# EasyEDA Pro project tmkibot1_2.1 MAX7219 – 8×8 Dot Matrix.eprj

# Schematic Schematic1
Board Name: Board1; Create Date: 2025-09-20; Page Name: P1; Project Name: tmkibot1_2.1 MAX7219 – 8×8 Dot Matrix; Schematic Name: Schematic1; Update Date: 2025-09-20; Company: EasyEDA.com; Page Size: A4; Version: V1.0
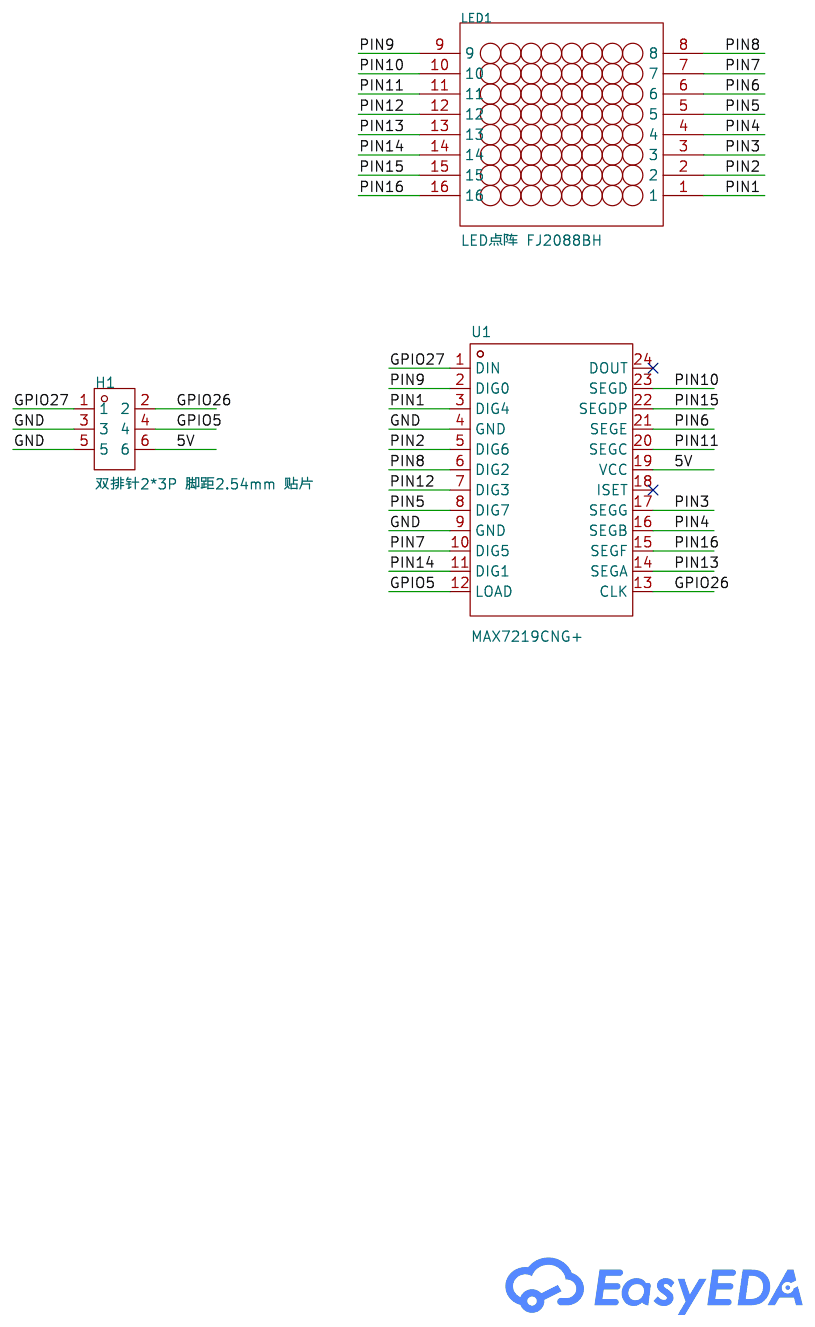
[diagram p0: schematic sheet]

## Parts
H1  双排针2*3P 脚距2.54mm 贴片  [HDR-SMD_6P-P2.54-V-M-R2-C3-S2.54-LS7.4]
LED1  LED点阵 FJ2088BH  [LED-ARRAY-TH_L61.0-W61.0-P2.54-LS45.7-L]
U1  MAX7219CNG+  [DIP-24_L31.7-W6.6-P2.54-LS7.6-BL-2]

## Library data of the parts
H1 = 双排针2*3P 脚距2.54mm 贴片: LCSC Part Name: 间距:2.54mm; Supplier Part: C77761; Manufacturer: BOOMELE(博穆精密); Supplier Footprint: SMD,P=2.54mm; JLCPCB Part Class: Extended Part; Supplier: LCSC; Pitch: 2.54mm; Row Spacing: 2.54mm; Number of Rows: 2; Number of Pins: 6P; Color: Black
LED1 = LED点阵 FJ2088BH: LCSC Part Name: 8x8位共阴极红色LED点阵; Supplier Part: C53078; Manufacturer: 志浩; Supplier Footprint: 插件; JLCPCB Part Class: Extended Part; Datasheet: https://atta.szlcsc.com/upload/public/pdf/source/20151111/1457707576541.pdf; Supplier: LCSC; Dot Matrix Number: 8x8; Emitting Color: Red; Polarity: 共阴极
U1 = MAX7219CNG+: LCSC Part Name: 串行接口8位LED显示驱动器; Supplier Part: C29160; Manufacturer: ADI(亚德诺)/MAXIM(美信); Supplier Footprint: DIP-24-300mil; JLCPCB Part Class: Extended Part; Datasheet: https://item.szlcsc.com/datasheet/MAX7219CNG%252B/29912.html; Supplier: LCSC

## Nets
5V: H1.6 U1.19(VCC)
GND: H1.3 H1.5 U1.4(GND) U1.9(GND)
GPIO5: H1.4 U1.12(LOAD)
GPIO26: H1.2 U1.13(CLK)
GPIO27: H1.1 U1.1(DIN)
PIN1: LED1.1 U1.3(DIG4)
PIN2: LED1.2 U1.5(DIG6)
PIN3: LED1.3 U1.17(SEGG)
PIN4: LED1.4 U1.16(SEGB)
PIN5: LED1.5 U1.8(DIG7)
PIN6: LED1.6 U1.21(SEGE)
PIN7: LED1.7 U1.10(DIG5)
PIN8: LED1.8 U1.6(DIG2)
PIN9: LED1.9 U1.2(DIG0)
PIN10: LED1.10 U1.23(SEGD)
PIN11: LED1.11 U1.20(SEGC)
PIN12: LED1.12 U1.7(DIG3)
PIN13: LED1.13 U1.14(SEGA)
PIN14: LED1.14 U1.11(DIG1)
PIN15: LED1.15 U1.22(SEGDP)
PIN16: LED1.16 U1.15(SEGF)

Not connected (* = marked no-connect by the designer): U1 18(ISET)* 24(DOUT)*

# Board PCB1
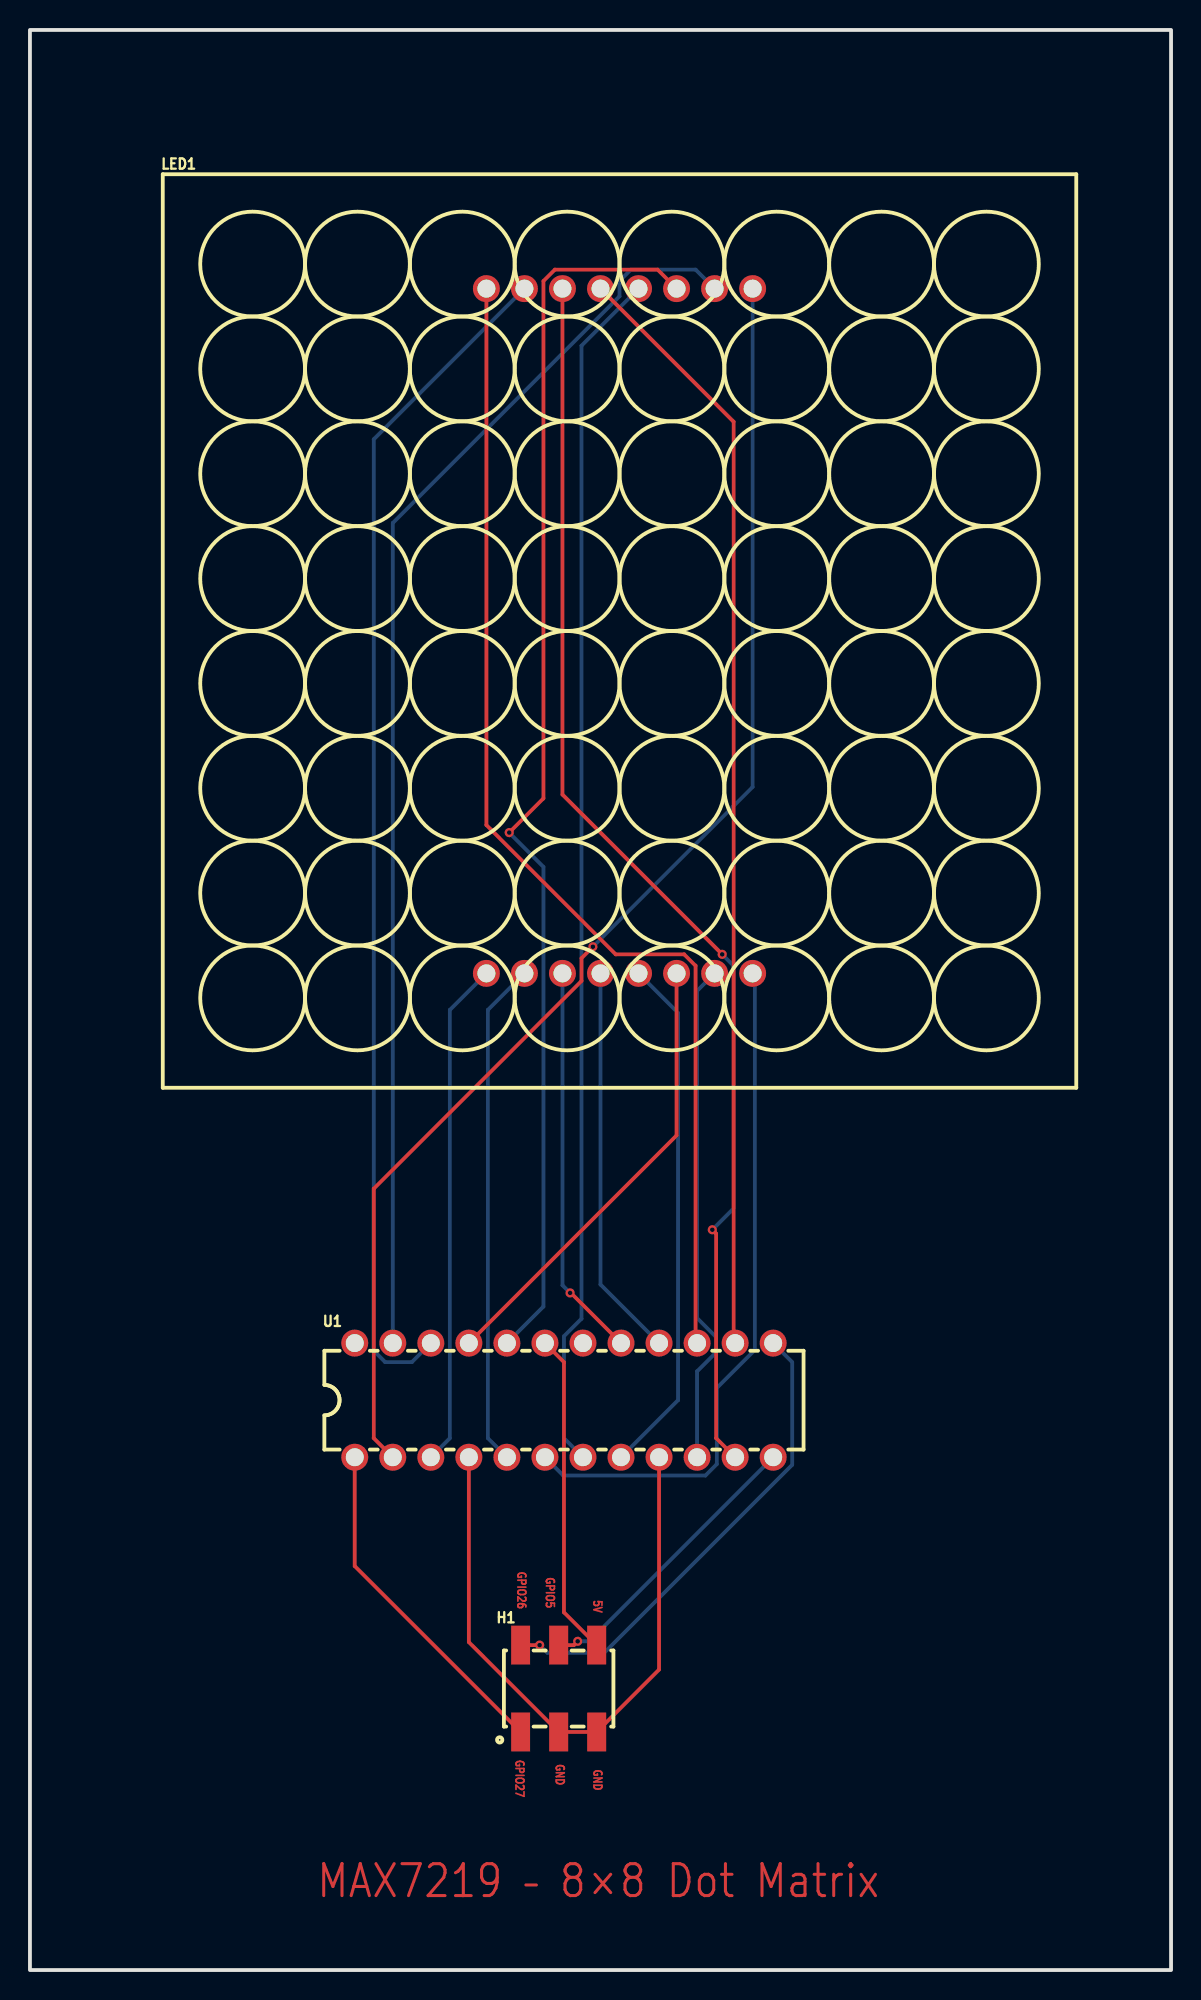
[diagram p1: board, top side]
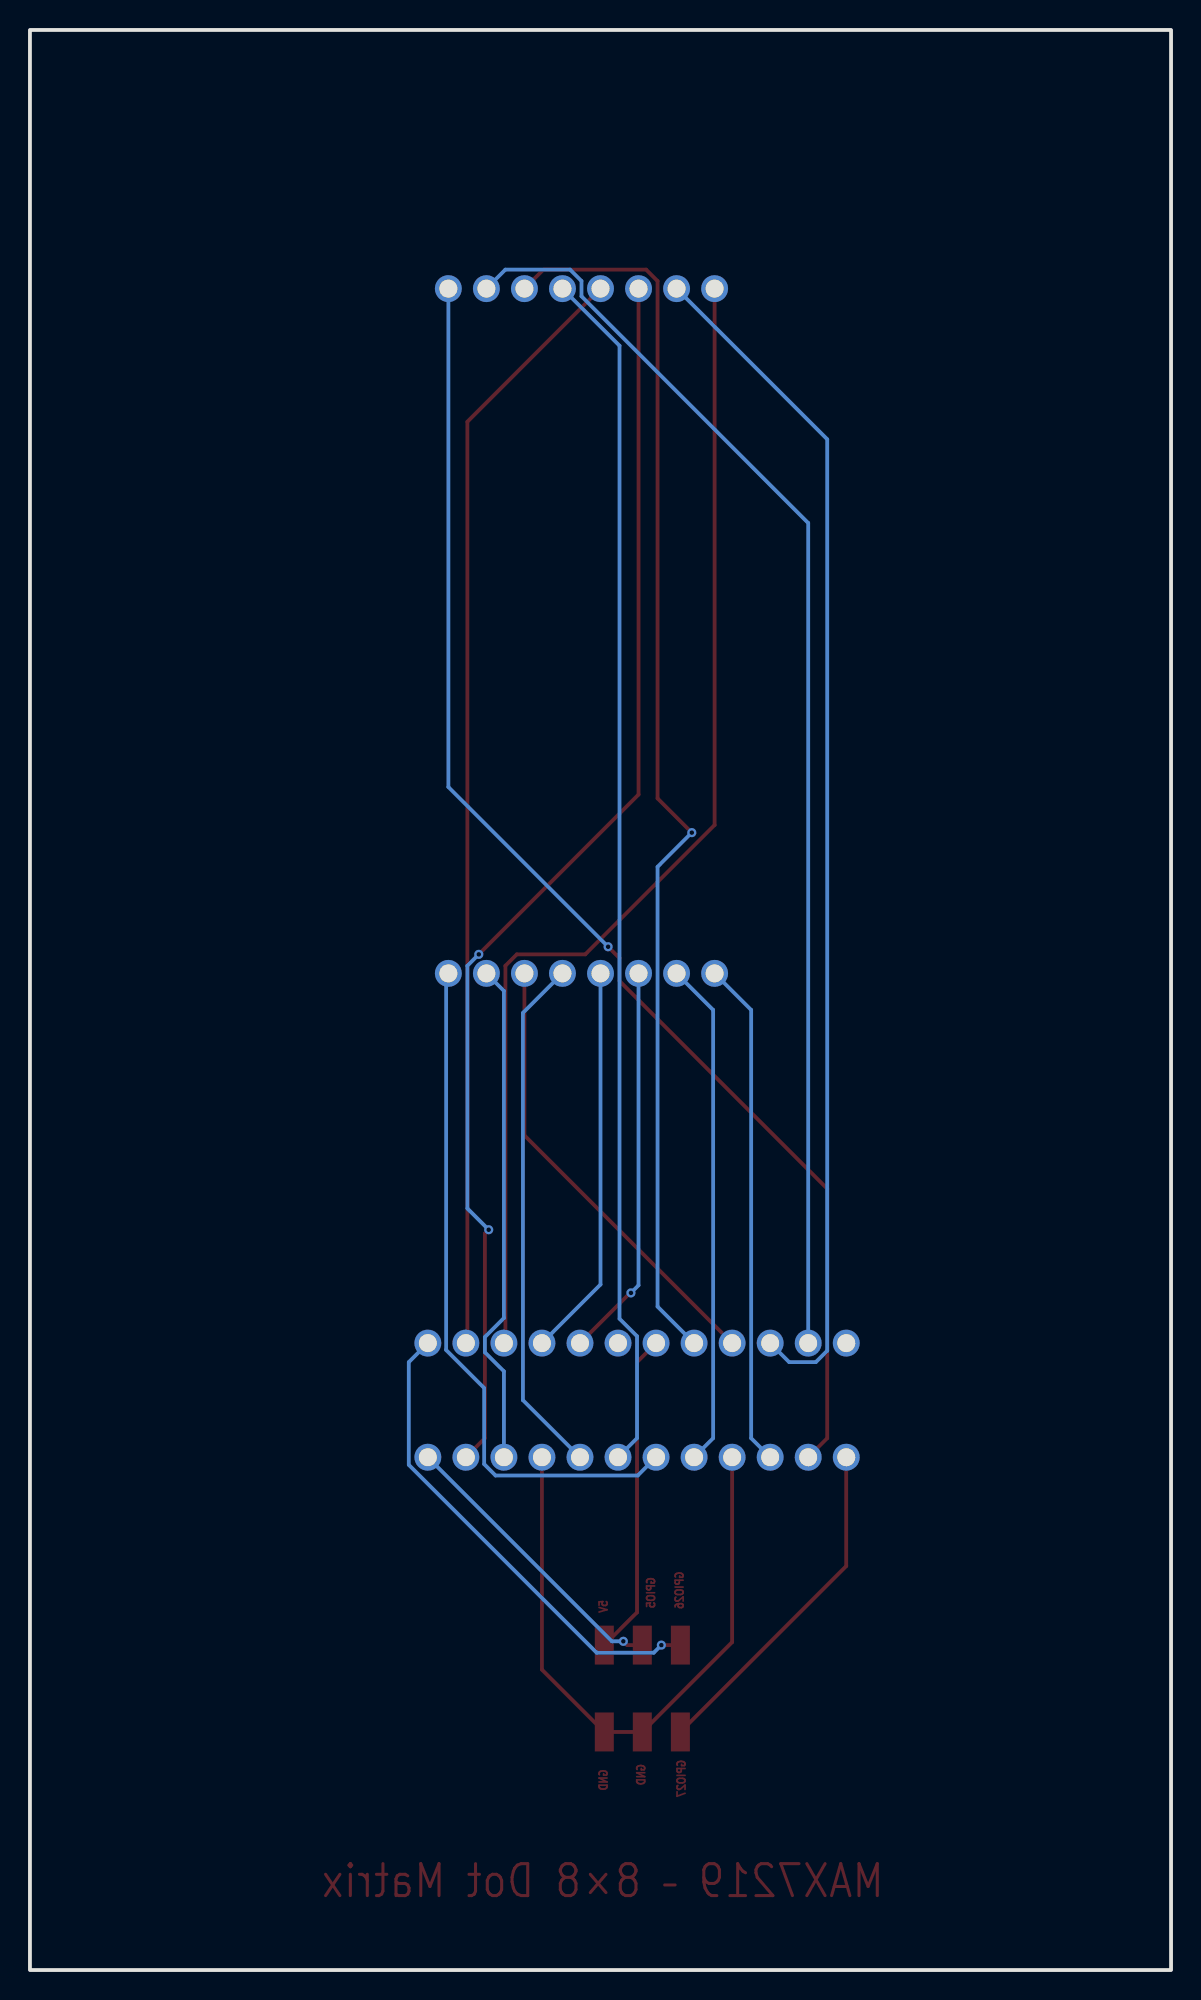
[diagram p2: board, bottom side, seen from below]

Outline 76.2 x 129.54 mm; copper layers: Top Layer, Bottom Layer. Coordinates in mm from the lower left corner of the outline.
Outline path: rectangle 0,129.54 76.2,0
Stack: Top Layer 0.035mm / Dielectric1 1.51mm FR4 er 4.5 / Bottom Layer 0.035mm

## Design rules (mm)
template: JLCPCB Capability(Two Layers Board)
spacing copperThickness1oz (default): track to track 0.102, other pairs 0.152 to 0.3
spacing copperThickness2oz: track to track 0.203, other pairs 0.152 to 0.3
track width copperThickness1oz (default): min 0.127, default 0.254, max 2.54
track width copperThickness2oz: min 0.203, default 0.254, max 2.54
differential pair differentialPair (default): width min 0.127, default 0.254, max 2.54; gap min 0.152, default 0.152
via viaSize (default): diameter min 0.5, default 0.61, max 10; hole min 0.3, default 0.305, max 6.3

## Placement (name value [footprint] x y rotation side)
H1  双排针2*3P 脚距2.54mm 贴片  [HDR-SMD_6P-P2.54-V-M-R2-C3-S2.54-LS7.4]  35.31 18.8 0 top
LED1  LED点阵 FJ2088BH  [LED-ARRAY-TH_L61.0-W61.0-P2.54-LS45.7-L]  39.37 89.41 0 top
U1  MAX7219CNG+  [DIP-24_L31.7-W6.6-P2.54-LS7.6-BL-2]  35.66 38.05 0 top

## Footprints (pads in the part's own frame, mm; a bottom-side part is the same pattern mirrored in y, then rotated)
DIP-24_L31.7-W6.6-P2.54-LS7.6-BL-2
  round 1.8 hole 1.2: 1(-13.97,-3.81) 2(-11.43,-3.81) 3(-8.89,-3.81) 4(-6.35,-3.81) 5(-3.81,-3.81) 6(-1.27,-3.81) 7(1.27,-3.81) 8(3.81,-3.81) 9(6.35,-3.81) 10(8.89,-3.81) 11(11.43,-3.81) 12(13.97,-3.81) 13(13.97,3.81) 14(11.43,3.81) 15(8.89,3.81) 16(6.35,3.81) 17(3.81,3.81) 18(1.27,3.81) 19(-1.27,3.81) 20(-3.81,3.81) 21(-6.35,3.81) 22(-8.89,3.81) 23(-11.43,3.81) 24(-13.97,3.81)
HDR-SMD_6P-P2.54-V-M-R2-C3-S2.54-LS7.4
  rect 1.27x2.6 smd: 1(-2.54,-2.9) 2(-2.54,2.9) 3(0,-2.9) 4(0,2.9) 5(2.54,-2.9) 6(2.54,2.9)
LED-ARRAY-TH_L61.0-W61.0-P2.54-LS45.7-L
  round 1.8 hole 1.2: 1(-8.89,-22.86) 2(-6.35,-22.86) 3(-3.81,-22.86) 4(-1.27,-22.86) 5(1.27,-22.86) 6(3.81,-22.86) 7(6.35,-22.86) 8(8.89,-22.86) 9(8.89,22.86) 10(6.35,22.86) 11(3.81,22.86) 12(1.27,22.86) 13(-1.27,22.86) 14(-3.81,22.86) 15(-6.35,22.86) 16(-8.89,22.86)

## Nets
As in the schematic.

Pads without a net: U1 18 24

## Via types
v1: diameter 0.61, hole 0.305, Top Layer to Bottom Layer, 7 vias

## Routing (per net, layer and track width the routed paths; a pad name or vN(x,y) marks a point on that pad's centre or on a via; arc(x,y) is an arc through that point)
5V: length 21.6
  Top Layer w0.254: 37.85,21.7 35.66,23.88 35.66,40.59 U1.19
GND: length 43.4
  Top Layer w0.254: U1.9 42.01,20.06 H1.5 H1.3 29.31,21.89 U1.4
GPIO5: length 19.5
  Top Layer w0.254: 35.31,21.7 36.32,21.7 v1(36.58,21.95)
  Bottom Layer w0.254: U1.12 37.34,21.95 v1(36.58,21.95)
GPIO26: length 32.2
  Top Layer w0.254: 32.77,21.7 v1(34.04,21.7)
  Bottom Layer w0.254: U1.13 50.9,40.59 50.9,33.73 38.35,21.19 34.54,21.19 v1(34.04,21.7)
GPIO27: length 22.9
  Top Layer w0.254: U1.1 21.69,26.97 H1.1
PIN1: length 33.8
  Bottom Layer w0.254: U1.3 28.04,35.51 28.04,64.11 LED1.1
PIN2: length 33.8
  Bottom Layer w0.254: U1.5 30.58,35.51 30.58,64.11 LED1.2
PIN3: length 26.3
  Top Layer w0.254: U1.17 36.12,45.21 v1(36.07,45.21)
  Bottom Layer w0.254: LED1.3 35.56,45.72 v1(36.07,45.21)
PIN4: length 26.3
  Bottom Layer w0.254: LED1.4 38.1,45.77 U1.16
PIN5: length 35
  Bottom Layer w0.254: LED1.5 43.28,63.91 43.28,38.05 U1.8
PIN6: length 30.4
  Top Layer w0.254: U1.21 43.18,55.73 LED1.6
PIN7: length 33.8
  Bottom Layer w0.254: LED1.7 44.55,65.38 44.55,43.53 45.82,42.26 45.82,41.25 44.55,39.98 U1.10
PIN8: length 46.2
  Bottom Layer w0.254: U1.6 35.61,33.02 45.11,33.02 45.87,33.78 45.87,38.86 48.41,41.4 48.41,66.4 LED1.8
PIN9: length 89
  Top Layer w0.254: v1(37.59,68.33) 36.83,67.56 36.83,66.04 22.96,52.17 22.96,35.51 U1.2
  Bottom Layer w0.254: LED1.9 48.26,78.99 v1(37.59,68.33)
PIN10: length 84.4
  Bottom Layer w0.254: LED1.10 44.45,113.54 40.13,113.54 39.37,112.78 39.37,111.76 24.23,96.62 U1.23
PIN11: length 83.6
  Top Layer w0.254: LED1.11 41.91,113.54 35.05,113.54 34.29,112.78 34.29,78.23 v1(32,75.95)
  Bottom Layer w0.254: v1(32,75.95) 34.29,73.66 34.29,44.3 U1.20
PIN12: length 80.6
  Bottom Layer w0.254: U1.7 35.66,35.51 35.66,42.32 36.83,43.49 36.83,108.46 LED1.12
PIN13: length 74.1
  Top Layer w0.254: U1.14 46.99,41.96 46.99,103.38 LED1.13
PIN14: length 84
  Top Layer w0.254: v1(45.57,49.43) 45.82,49.18 45.82,35.51 U1.11 ; v1(46.23,67.82) 35.56,78.49 LED1.14
  Bottom Layer w0.254: v1(46.23,67.82) 46.99,67.06 46.99,50.85 v1(45.57,49.43)
PIN15: length 79.7
  Bottom Layer w0.254: LED1.15 22.96,102.21 22.96,41.35 23.72,40.59 25.5,40.59 U1.22
PIN16: length 78.9
  Top Layer w0.254: U1.15 44.45,41.96 44.45,67.06 43.69,67.82 39.12,67.82 30.48,76.45 LED1.16

## Text on the board
Top Layer: GPIO27 | GPIO26 | GND | 5V | GPIO5 | MAX7219 – 8×8 Dot Matrix
